# Altium schematic sheet Main.SchDoc: Main
size B; Author: Craig Hesling; DrawnBy: Craig Hesling; Revision: 1; SheetNumber: 1; SheetTotal: 7
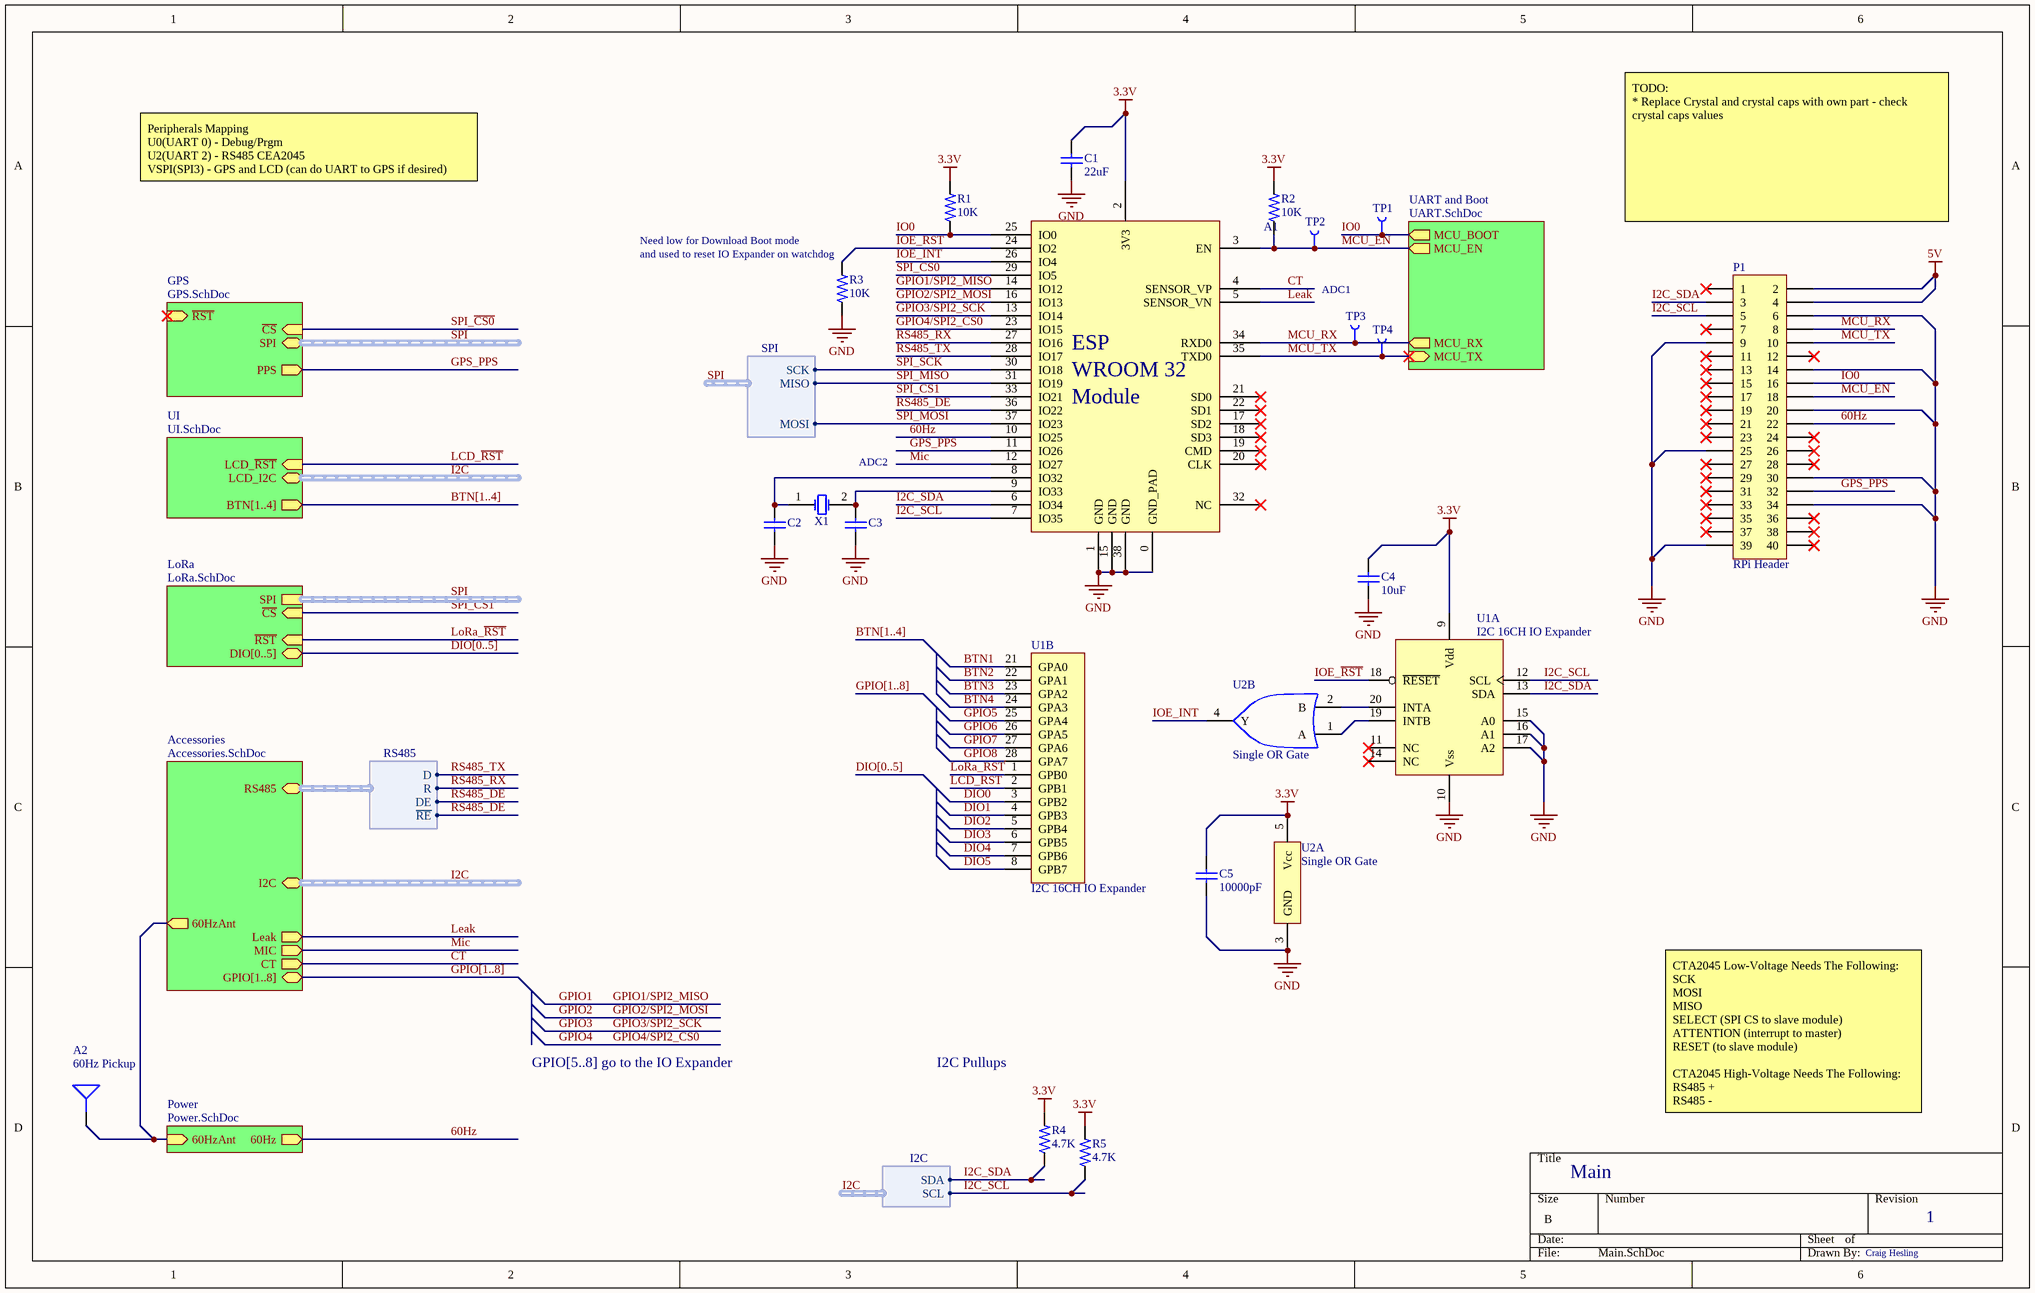
[diagram p0: Main.SchDoc]

## Parts
A1  ESP-WROOM-32  [ESP-WROOM-32]  (value not drawn)
A2  60Hz Pickup  [60HzPickup]
C1  22uF  [CAPC2013X14L - CAP0805 1.45mm Tall]
C2  CAP 12pF 16V 0603(1608)  [CAPC0603(1608)100_M]  (value not drawn)
C3  CAP 12pF 16V 0603(1608)  [CAPC0603(1608)100_M]  (value not drawn)
C4  10uF  [CAPC2013X14L - CAP0805 1.45mm Tall]
C5  10000pF  [CAPC1608X09L - CAP0603]
P1  RPi Header  [HDR2X20]
R1  10K  [RESC1608X06L - RES0603]
R2  10K  [RESC1608X06L - RES0603]
R3  10K  [RESC1608X06L - RES0603]
R4  4.7K  [RESC1608X06L - RES0603]
R5  4.7K  [RESC1608X06L - RES0603]
TP1  Test Point  [TestPoint1]  (value not drawn)
TP2  Test Point  [TestPoint1]  (value not drawn)
TP3  Test Point  [TestPoint1]  (value not drawn)
TP4  Test Point  [TestPoint1]  (value not drawn)
U1  I2C 16CH IO Expander  [SOIC127P1030X265-28L]  (parts A,B of 2)
U2  Single OR Gate  [SOT95P280X140-5L]  (parts A,B of 2)
X1  14340272-32.768KHz  [ITTI-14340272-32.768KHz-2_V]  (value not drawn)

## Sub-sheets
Accessories = Accessories.SchDoc: Leak (out), MIC (out), CT (out), I2C (harness I2C), GPIO[1..8] (bidir), RS485 (harness RS485), 60HzAnt (out)
GPS = GPS.SchDoc: SPI (harness SPI), ~{CS} (in), PPS (out), ~{RST} (in)
LoRa = LoRa.SchDoc: DIO[0..5] (bidir), SPI (harness SPI), ~{CS} (in), ~{RST} (in)
Power = Power.SchDoc: 60Hz (out), 60HzAnt (in)
UART and Boot = UART.SchDoc: MCU_EN (out), MCU_BOOT (out), MCU_RX (out), MCU_TX (in)
UI = UI.SchDoc: BTN[1..4] (out), LCD_~{RST} (in), LCD_I2C (harness I2C)

## Harnesses
SPI: MISO, MOSI, SCK
RS485: R, ~{RE}, DE, D
I2C: SDA, SCL

## Nets
3.3V: A1.2(3V3) C1.2 C4.2 C5.2 R1.2 R2.2 R4.2 R5.2 U1.9(Vdd) U2.5(Vcc)
5V: P1.2 P1.4
GND: A1.0(GND_PAD) A1.1(GND) A1.15(GND) A1.38(GND) C1.1 C2.1 C3.1 C4.1 C5.1 P1.6 P1.9 P1.14 P1.20 P1.25 P1.30 P1.34 P1.39 R3.1 U1.10(Vss) U1.15(A0) U1.16(A1) U1.17(A2) U2.3(GND)
60Hz: A1.10(IO25) P1.22 ; sheet Power/60Hz
BTN1: U1.21(GPA0)
BTN2: U1.22(GPA1)
BTN3: U1.23(GPA2)
BTN4: U1.24(GPA3)
CT: A1.4(SENSOR_VP) ; sheet Accessories/CT
DIO0: U1.3(GPB2)
DIO1: U1.4(GPB3)
DIO2: U1.5(GPB4)
DIO3: U1.6(GPB5)
DIO4: U1.7(GPB6)
DIO5: U1.8(GPB7)
GPIO1: A1.14(IO12)  [also labelled GPIO1/SPI2_MISO]
GPIO2: A1.16(IO13)  [also labelled GPIO2/SPI2_MOSI]
GPIO3: A1.13(IO14)  [also labelled GPIO3/SPI2_SCK]
GPIO4: A1.23(IO15)  [also labelled GPIO4/SPI2_~{CS0}]
GPIO5: U1.25(GPA4)
GPIO6: U1.26(GPA5)
GPIO7: U1.27(GPA6)
GPIO8: U1.28(GPA7)
GPS_PPS: A1.11(IO26) P1.32 ; sheet GPS/PPS
I2C_SCL: A1.7(IO35) P1.5 R5.1 U1.12(SCL) ; sheet Accessories/I2C.SCL  [project net I2C.SCL]
I2C_SDA: A1.6(IO34) P1.3 R4.1 U1.13(SDA) ; sheet Accessories/I2C.SDA  [project net I2C.SDA]
IO0: A1.25(IO0) P1.16 R1.1 TP1.1(P1) ; sheet UART and Boot/MCU_BOOT
IOE_INT: A1.26(IO4) U2.4(Y)
IOE_~{RST}: A1.24(IO2) R3.2 U1.18(~{RESET})
LCD_~{RST}: U1.2(GPB1) ; sheet UI/LCD_~{RST}
Leak: A1.5(SENSOR_VN) ; sheet Accessories/Leak
LoRa_~{RST}: U1.1(GPB0) ; sheet LoRa/~{RST}
MCU_EN: A1.3(EN) P1.18 R2.1 TP2.1(P1) ; sheet UART and Boot/MCU_EN
MCU_RX: A1.34(RXD0) P1.8 TP3.1(P1) ; sheet UART and Boot/MCU_RX
MCU_TX: A1.35(TXD0) P1.10 TP4.1(P1) ; sheet UART and Boot/MCU_TX
Mic: A1.12(IO27) ; sheet Accessories/MIC
RS485_DE: A1.36(IO22) ; sheet Accessories/RS485.~{RE}, sheet Accessories/RS485.DE
RS485_RX: A1.27(IO16) ; sheet Accessories/RS485.R
RS485_TX: A1.28(IO17) ; sheet Accessories/RS485.D
SPI_~{CS0}: A1.29(IO5) ; sheet GPS/~{CS}
SPI_~{CS1}: A1.33(IO21) ; sheet LoRa/~{CS}
SPI_MISO: A1.31(IO19) ; sheet GPS/SPI.MISO  [project net SPI.MISO]
SPI_MOSI: A1.37(IO23) ; sheet GPS/SPI.MOSI  [project net SPI.MOSI]
SPI_SCK: A1.30(IO18) ; sheet GPS/SPI.SCK  [project net SPI.SCK]
NetA1_8: A1.8(IO32) C2.2 X1.1(X1)
NetA1_9: A1.9(IO33) C3.2 X1.2(X2)
NetA2_1: A2.1(Ant) ; sheet Power/60HzAnt, sheet Accessories/60HzAnt
NetU1_19: U1.19(INTB) U2.1(A)
NetU1_20: U1.20(INTA) U2.2(B)

Not connected (* = marked no-connect by the designer): A1 17(SD2)* 18(SD3)* 19(CMD)* 20(CLK)* 21(SD0)* 22(SD1)* 32(NC)*; P1 1* 7* 11* 12* 13* 15* 17* 19* 21* 23* 24* 26* 27* 28* 29* 31* 33* 35* 36* 37* 38* 40*; U1 11(NC)* 14(NC)*

## Buses and harness runs
bus BTN[1..4]
bus BTN[1..4] = sheet UI/BTN[1..4]
bus DIO[0..5]
bus DIO[0..5] = sheet LoRa/DIO[0..5]
bus GPIO[1..8]
bus GPIO[1..8] = sheet Accessories/GPIO[1..8]
harness I2C = sheet Accessories/I2C
harness I2C = sheet UI/LCD_I2C
harness SPI = sheet GPS/SPI
harness SPI = sheet LoRa/SPI

## Notes on the sheet
- Peripherals Mapping
  U0(UART 0) - Debug/Prgm
  U2(UART 2) - RS485 CEA2045
  VSPI(SPI3) - GPS and LCD (can do UART to GPS if desired)
  HSPI/HS2(Host SD 2) - SD Card
- TODO:
  * Replace Crystal and crystal caps with own part - check crystal caps values
- (near R3) Need low for Download Boot mode
- (near R3) and used to reset IO Expander on watchdog
- ADC1
- ADC2
- GPIO[5..8] go to the IO Expander
- I2C Pullups
- CTA2045 Low-Voltage Needs The Following:
  SCK
  MOSI
  MISO
  SELECT (SPI CS to slave module)
  ATTENTION (interrupt to master)
  RESET (to slave module)
  CTA2045 High-Voltage Needs The Following:
  RS485 +
  RS485 -
- (in symbol ESP-WROOM-32) ESP; WROOM 32; Module

## Library data of the parts
A1 = ESP-WROOM-32: ESP WROOM 32 Module; Supplier 1: Digi-Key; Supplier Part Number 1: 1528-1801-ND
A2 = 60Hz pickup with via: 5cm 60Hz pickup antenna with via for external wire
C1 = CAP0805 22uF 10% 6.3V X5R: SMT 0805 Ceramic Capacitor; TempCoeff: X5R; Tolerance: 10%; Voltage: 6.3V; Value: 22uF; Supplier 1: Digi-Key; Supplier Part Number 1: 1276-6687-1-ND; Supplier 2: Digi-Key; Supplier Part Number 2: 311-1860-1-ND
C2 C3 = CMP-1035-00607-1: CAP 12pF 16V ±10% 0603 (1608 Metric) Thickness 1mm SMD; Case-Metric: 1608; Tolerance: Â±10%; Case-EIA: 0603; Value: 12pF; Max Thickness: 1 mm; Technology: SMT; Rated Voltage: 16 V
C4 = CAP0805 10uF 10% 6.3V X5R: SMT 0805 Ceramic Capacitor; TempCoeff: X5R; Tolerance: 10%; Voltage: 6.3V; Value: 10uF; Supplier 1: Digi-Key; Supplier Part Number 1: 1276-6457-1-ND
C5 = CAP0603 10000pF 10% 50V X7R: SMT 0603 Ceramic Capacitor; TempCoeff: X7R; Tolerance: 10%; Voltage: 50V; Value: 10000pF; Supplier 1: Digi-Key; Supplier 2: Digi-Key; Supplier 3: Digi-Key; Supplier Part Number 1: 478-1215-1-ND; Supplier Part Number 2: 311-1080-1-ND; Supplier Part Number 3: 490-1494-1-ND
P1 = Header 20X2: Header, 20-Pin, Dual row; LatestRevisionDate: 17-Jul-2002; LatestRevisionNote: Re-released for DXP Platform.; Publisher: Altium Limited
R1-R3 = RES0603 10K 1% 1/10W: SMT 0603 Ceramic Resistor; Power: 1/10W; Tolerance: 1%; Supplier 1: Digi-Key; Supplier 2: Digi-Key; Supplier 3: Digi-Key; Supplier Part Number 1: 311-10.0KHRCT-ND; Supplier Part Number 2: RMCF0603FT10K0CT-ND; Supplier Part Number 3: P10.0KHCT-ND; Value: 10K
R4 R5 = RES0603 4.7K 1% 1/10W: SMT 0603 Ceramic Resistor; Power: 1/10W; Tolerance: 1%; Value: 4.7K; Supplier 1: Digi-Key; Supplier 2: Digi-Key; Supplier 3: Digi-Key; Supplier Part Number 1: 311-4.70KHRCT-ND; Supplier Part Number 2: P4.70KHCT-ND; Supplier Part Number 3: RMCF0603FT4K70CT-ND
TP1-TP4 = TestPoint1: Small 0.762mm Round Test Point
U1 = MCP23017T-E/SO: Microchip MCP23017 I2C 16CH IO Expander; Supplier 1: Digi-Key; Supplier Part Number 1: MCP23017T-E/SOCT-ND
U2 = NC7S32M5X: Fairchild/ON Semi NC7S32M5X Single OR Gate; Supplier 1: Digi-Key; Supplier Part Number 1: NC7S32M5XCT-ND
X1 = CMP-0463-00001-2: Crystal, 32.768 KHz, -40 to 85 degC, 3.2 x 1.5 x 0.9 mm SMD; Manufacturer: ITTI; Load Capacitance: 12.5 pF; Frequency Tolerance: +/-20 ppm; Drive Level: 1 max. uw; Nominal Frequency: 32.768KHz; Mounting Technology: Surface Mount; Operating temperature: -40 to 85 degC; PartNumber: 14340272-32.768KHz; ComponentLink1URL: http://www.itti-co.com; ComponentLink1Description: Manufacturer URL; PackageReference: 14340272-32.768KHz-2; PackageDescription: 2-Pin Hand Drawn, Body 3.2 x 1.5mm, Pitch 2.5 mm